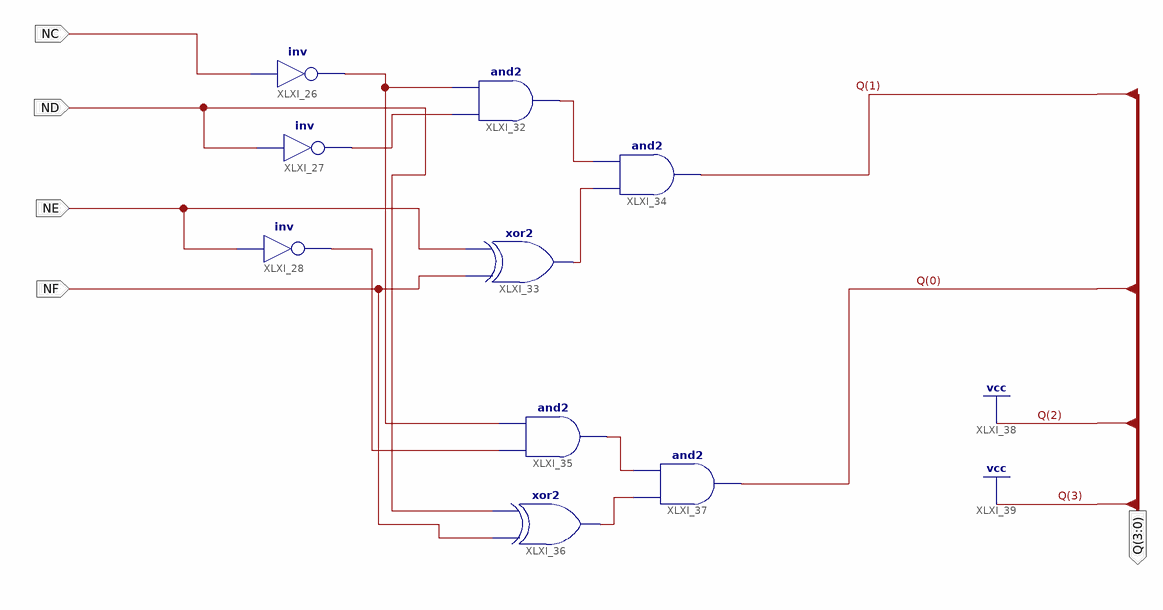
[diagram p0: schematic sheet 1]
// Xilinx ISE schematic NUMCF.sch (spartan6) as structural Verilog: 9 symbols, 5 ports
module NUMCF (
  input  NE,
  input  NF,
  input  NC,
  input  ND,
  output [3:0] Q
);

  wire XLXN_81, XLXN_82, XLXN_83, XLXN_84, XLXN_86, XLXN_88, XLXN_89;

  not XLXI_27 (XLXN_82, ND);
  not XLXI_28 (XLXN_86, NE);
  not XLXI_26 (XLXN_81, NC);
  and XLXI_32 (XLXN_83, XLXN_82, XLXN_81);
  xor XLXI_33 (XLXN_84, NF, NE);
  and XLXI_34 (Q[1], XLXN_84, XLXN_83);
  and XLXI_35 (XLXN_88, XLXN_86, XLXN_81);
  xor XLXI_36 (XLXN_89, NF, ND);
  and XLXI_37 (Q[0], XLXN_89, XLXN_88);

  assign Q[3:2] = 2'b11;
endmodule
